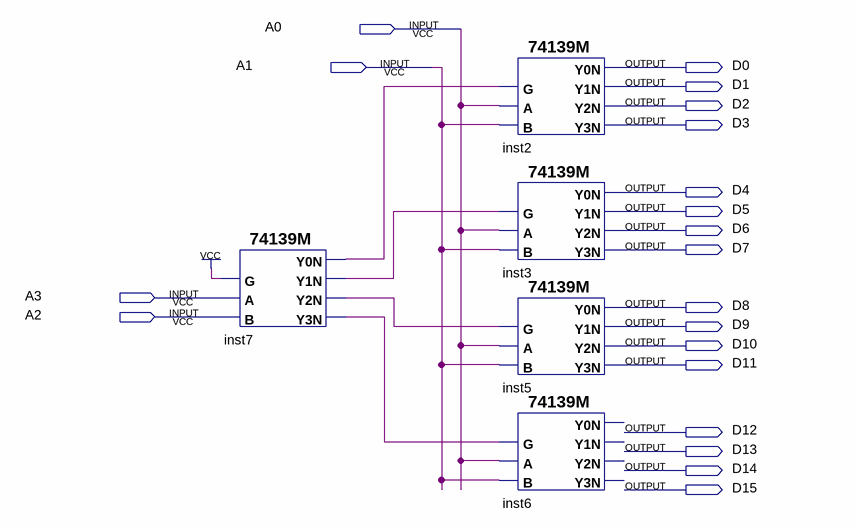
[diagram p0: schematic sheet]
// Quartus schematic lab3_g8_p3_1_2.bdf as structural Verilog: 5 symbols, 20 pins
module lab3_g8_p3_1_2 (
  input  A0,
  input  A1,
  input  A3,
  input  A2,
  output D0,
  output D1,
  output D2,
  output D3,
  output D4,
  output D5,
  output D6,
  output D7,
  output D8,
  output D9,
  output D10,
  output D11,
  output D12,
  output D13,
  output D14,
  output D15
);

  wire inst7_y0n, inst7_y1n, inst7_y2n, inst7_y3n;

  \74139M  inst7 (.B(A2), .A(A3), .G(1'b1), .Y3N(inst7_y3n), .Y2N(inst7_y2n), .Y0N(inst7_y0n), .Y1N(inst7_y1n));
  \74139M  inst2 (.B(A1), .A(A0), .G(inst7_y0n), .Y3N(D3), .Y2N(D2), .Y0N(D0), .Y1N(D1));
  \74139M  inst3 (.B(A1), .A(A0), .G(inst7_y1n), .Y3N(D7), .Y2N(D6), .Y0N(D4), .Y1N(D5));
  \74139M  inst5 (.B(A1), .A(A0), .G(inst7_y2n), .Y3N(D11), .Y2N(D10), .Y0N(D8), .Y1N(D9));
  \74139M  inst6 (.B(A1), .A(A0), .G(inst7_y3n));  // open: Y3N, Y2N, Y0N, Y1N
endmodule
